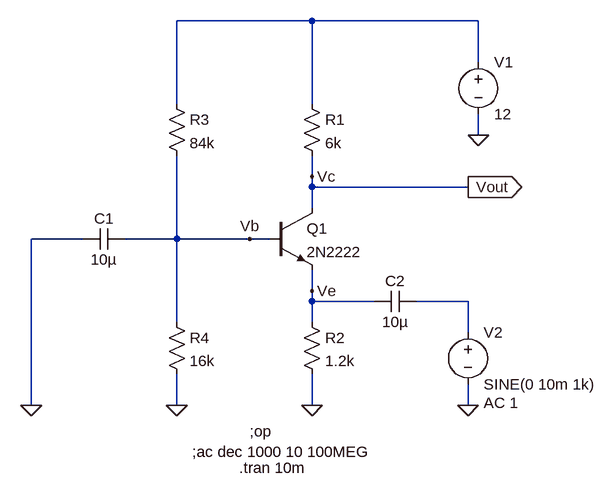
[diagram p0: schematic CB Amplifier.asc]
CB Amplifier.asc, the LTspice schematic file:
Version 4
SHEET 1 880 680
WIRE 224 -160 16 -160
WIRE 480 -160 224 -160
WIRE 480 -96 480 -160
WIRE 16 -32 16 -160
WIRE 224 -32 224 -160
WIRE 480 16 480 -16
WIRE 224 80 224 48
WIRE 224 96 224 80
WIRE 464 96 224 96
WIRE 224 128 224 96
WIRE -128 176 -208 176
WIRE 16 176 16 48
WIRE 16 176 -64 176
WIRE 128 176 16 176
WIRE 160 176 128 176
WIRE 224 256 224 224
WIRE 224 272 224 256
WIRE 320 272 224 272
WIRE 464 272 384 272
WIRE 16 304 16 176
WIRE 224 304 224 272
WIRE 464 320 464 272
WIRE -208 432 -208 176
WIRE 16 432 16 384
WIRE 224 432 224 384
WIRE 464 432 464 400
FLAG 16 432 0
FLAG 224 432 0
FLAG 480 16 0
FLAG -208 432 0
FLAG 464 432 0
FLAG 464 96 Vout
IOPIN 464 96 Out
FLAG 128 176 Vb
FLAG 224 80 Vc
FLAG 224 256 Ve
SYMBOL npn 160 128 R0
SYMATTR InstName Q1
SYMATTR Value 2N2222
SYMBOL res 208 -48 R0
SYMATTR InstName R1
SYMATTR Value 6k
SYMBOL res 208 288 R0
SYMATTR InstName R2
SYMATTR Value 1.2k
SYMBOL res 0 -48 R0
SYMATTR InstName R3
SYMATTR Value 84k
SYMBOL res 0 288 R0
SYMATTR InstName R4
SYMATTR Value 16k
SYMBOL voltage 480 -112 R0
WINDOW 123 0 0 Left 0
WINDOW 39 0 0 Left 0
SYMATTR InstName V1
SYMATTR Value 12
SYMBOL cap -64 160 R90
WINDOW 0 0 32 VBottom 2
WINDOW 3 32 32 VTop 2
SYMATTR InstName C1
SYMATTR Value 10µ
SYMBOL cap 384 256 R90
WINDOW 0 0 32 VBottom 2
WINDOW 3 32 32 VTop 2
SYMATTR InstName C2
SYMATTR Value 10µ
SYMBOL voltage 464 304 R0
WINDOW 123 24 124 Left 2
WINDOW 39 0 0 Left 0
SYMATTR Value2 AC 1
SYMATTR InstName V2
SYMATTR Value SINE(0 10m 1k)
TEXT 128 472 Left 2 !;op
TEXT 40 504 Left 2 !;ac dec 1000 10 100MEG
TEXT 112 528 Left 2 !.tran 10m

The netlist it stands for:
* CB Amplifier.asc
Q1 Vc Vb Ve 0 2N2222
R1 N001 Vc 6k
R2 Ve 0 1.2k
R3 N001 Vb 84k
R4 Vb 0 16k
V1 N001 0 12
C1 Vb 0 10µ
C2 N002 Ve 10µ
V2 N002 0 SINE(0 10m 1k) AC 1
.model NPN NPN
.model PNP PNP
.lib standard.bjt
;op
;ac dec 1000 10 100MEG
.tran 10m
.backanno
.end